# Altium schematic sheet STM32F429_Project.SchDoc: STM32F429NIH6核心开发板
size A1; Author: 唐文军 @ TJ; DrawnBy: 唐文军 @ TJ; Revision: V 2.00
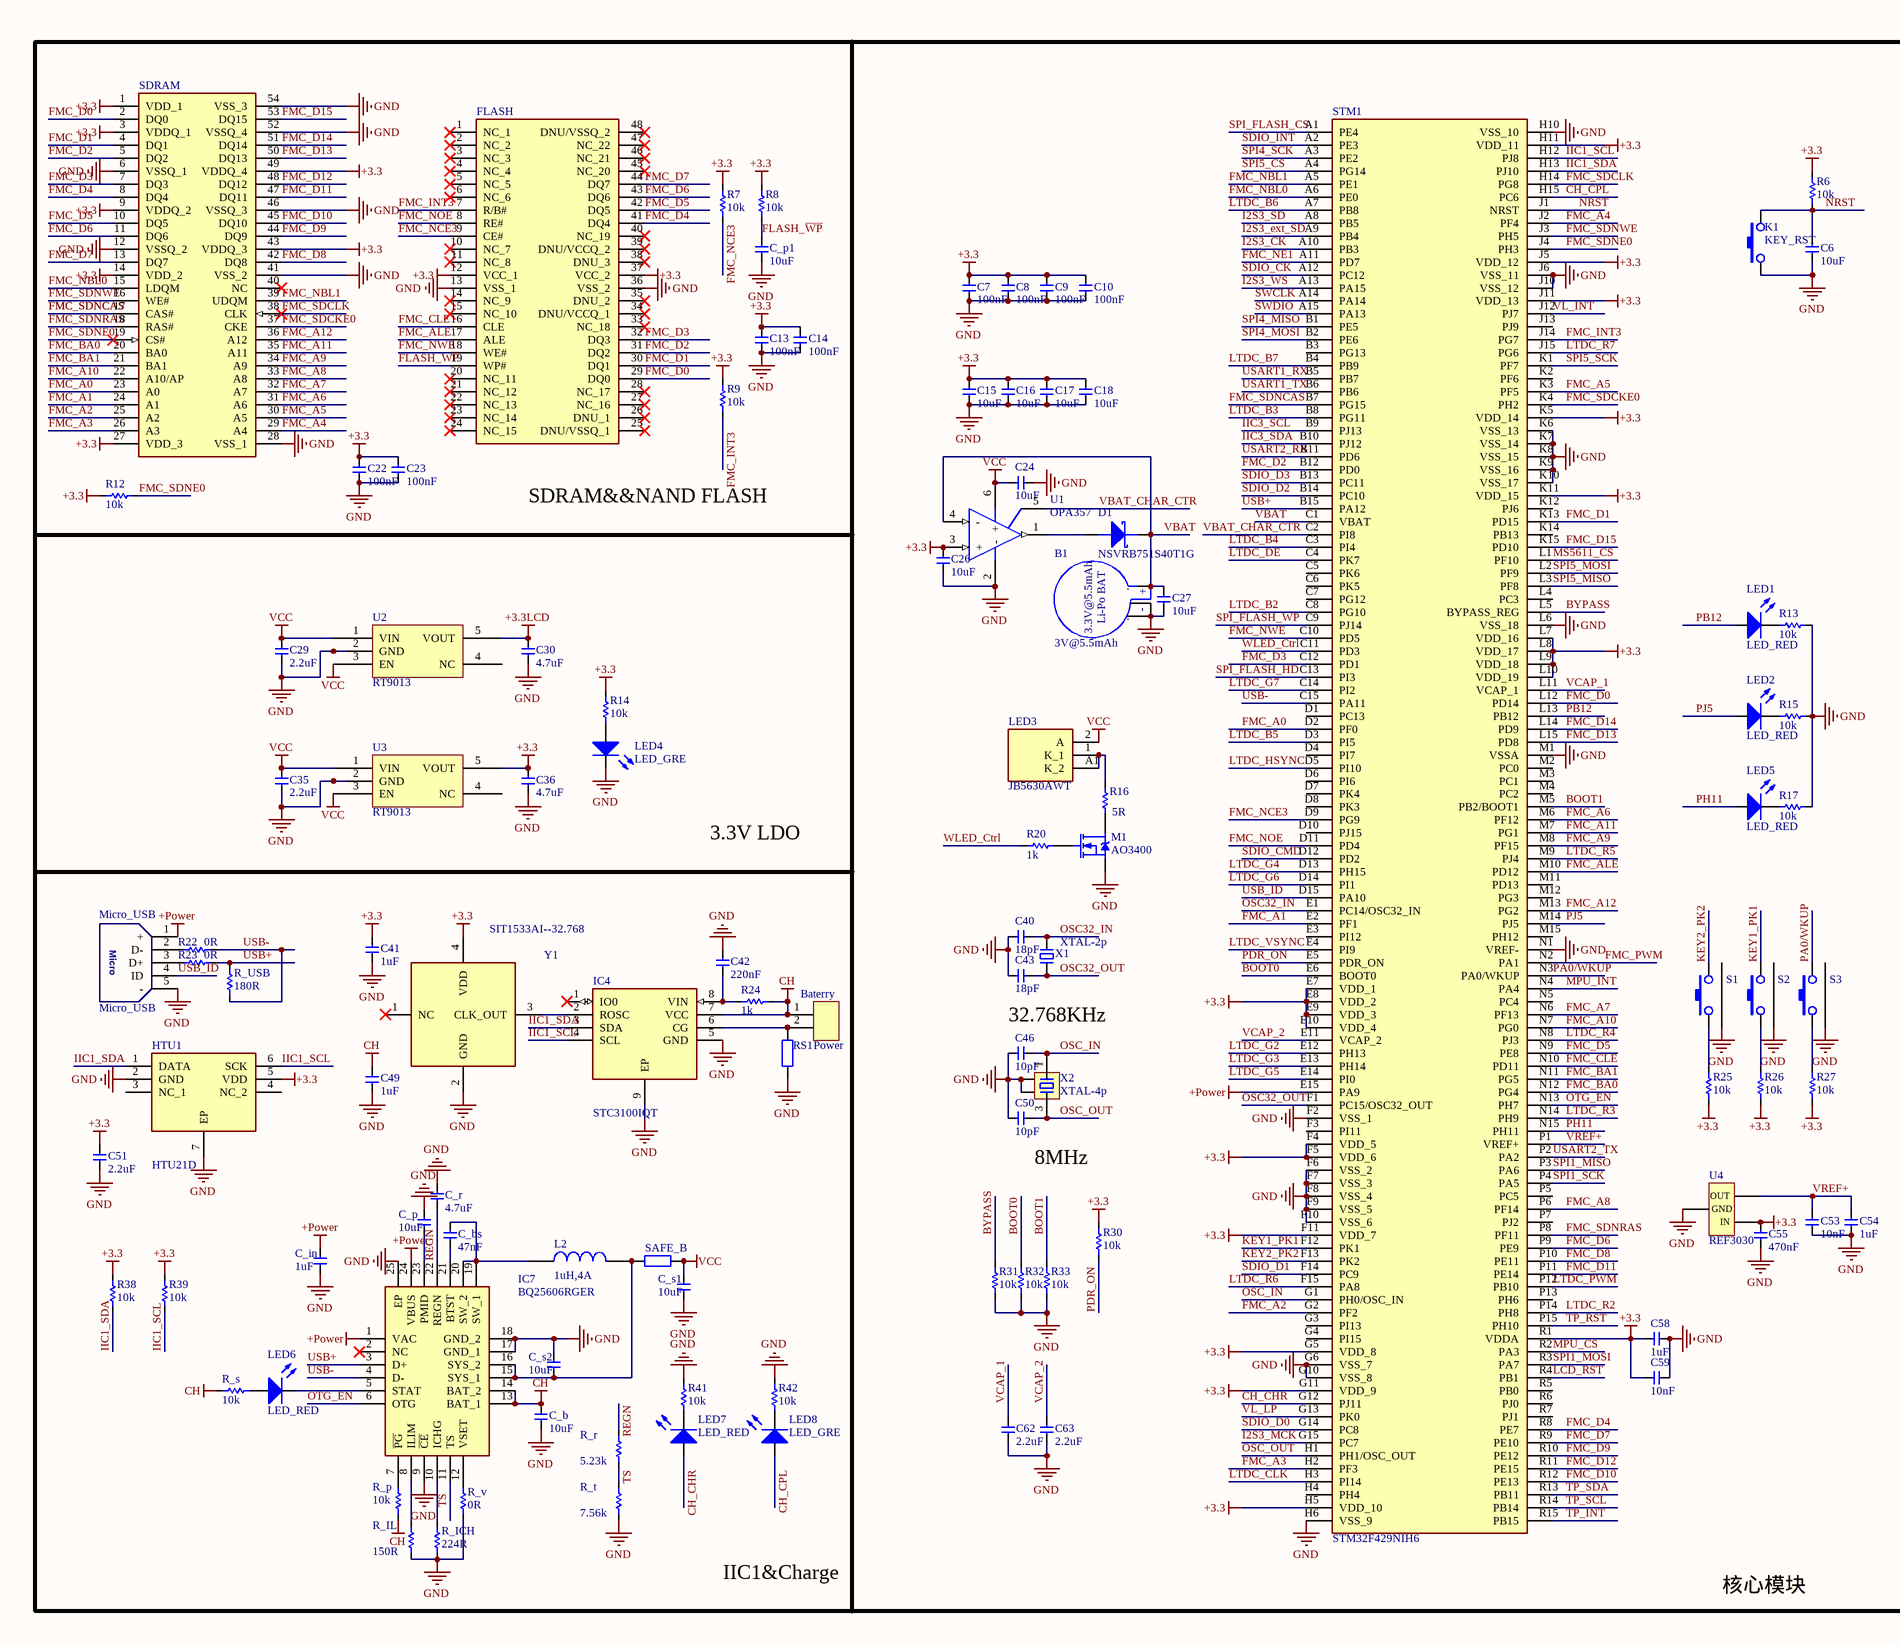
[diagram p0: STM32F429_Project.SchDoc, left]
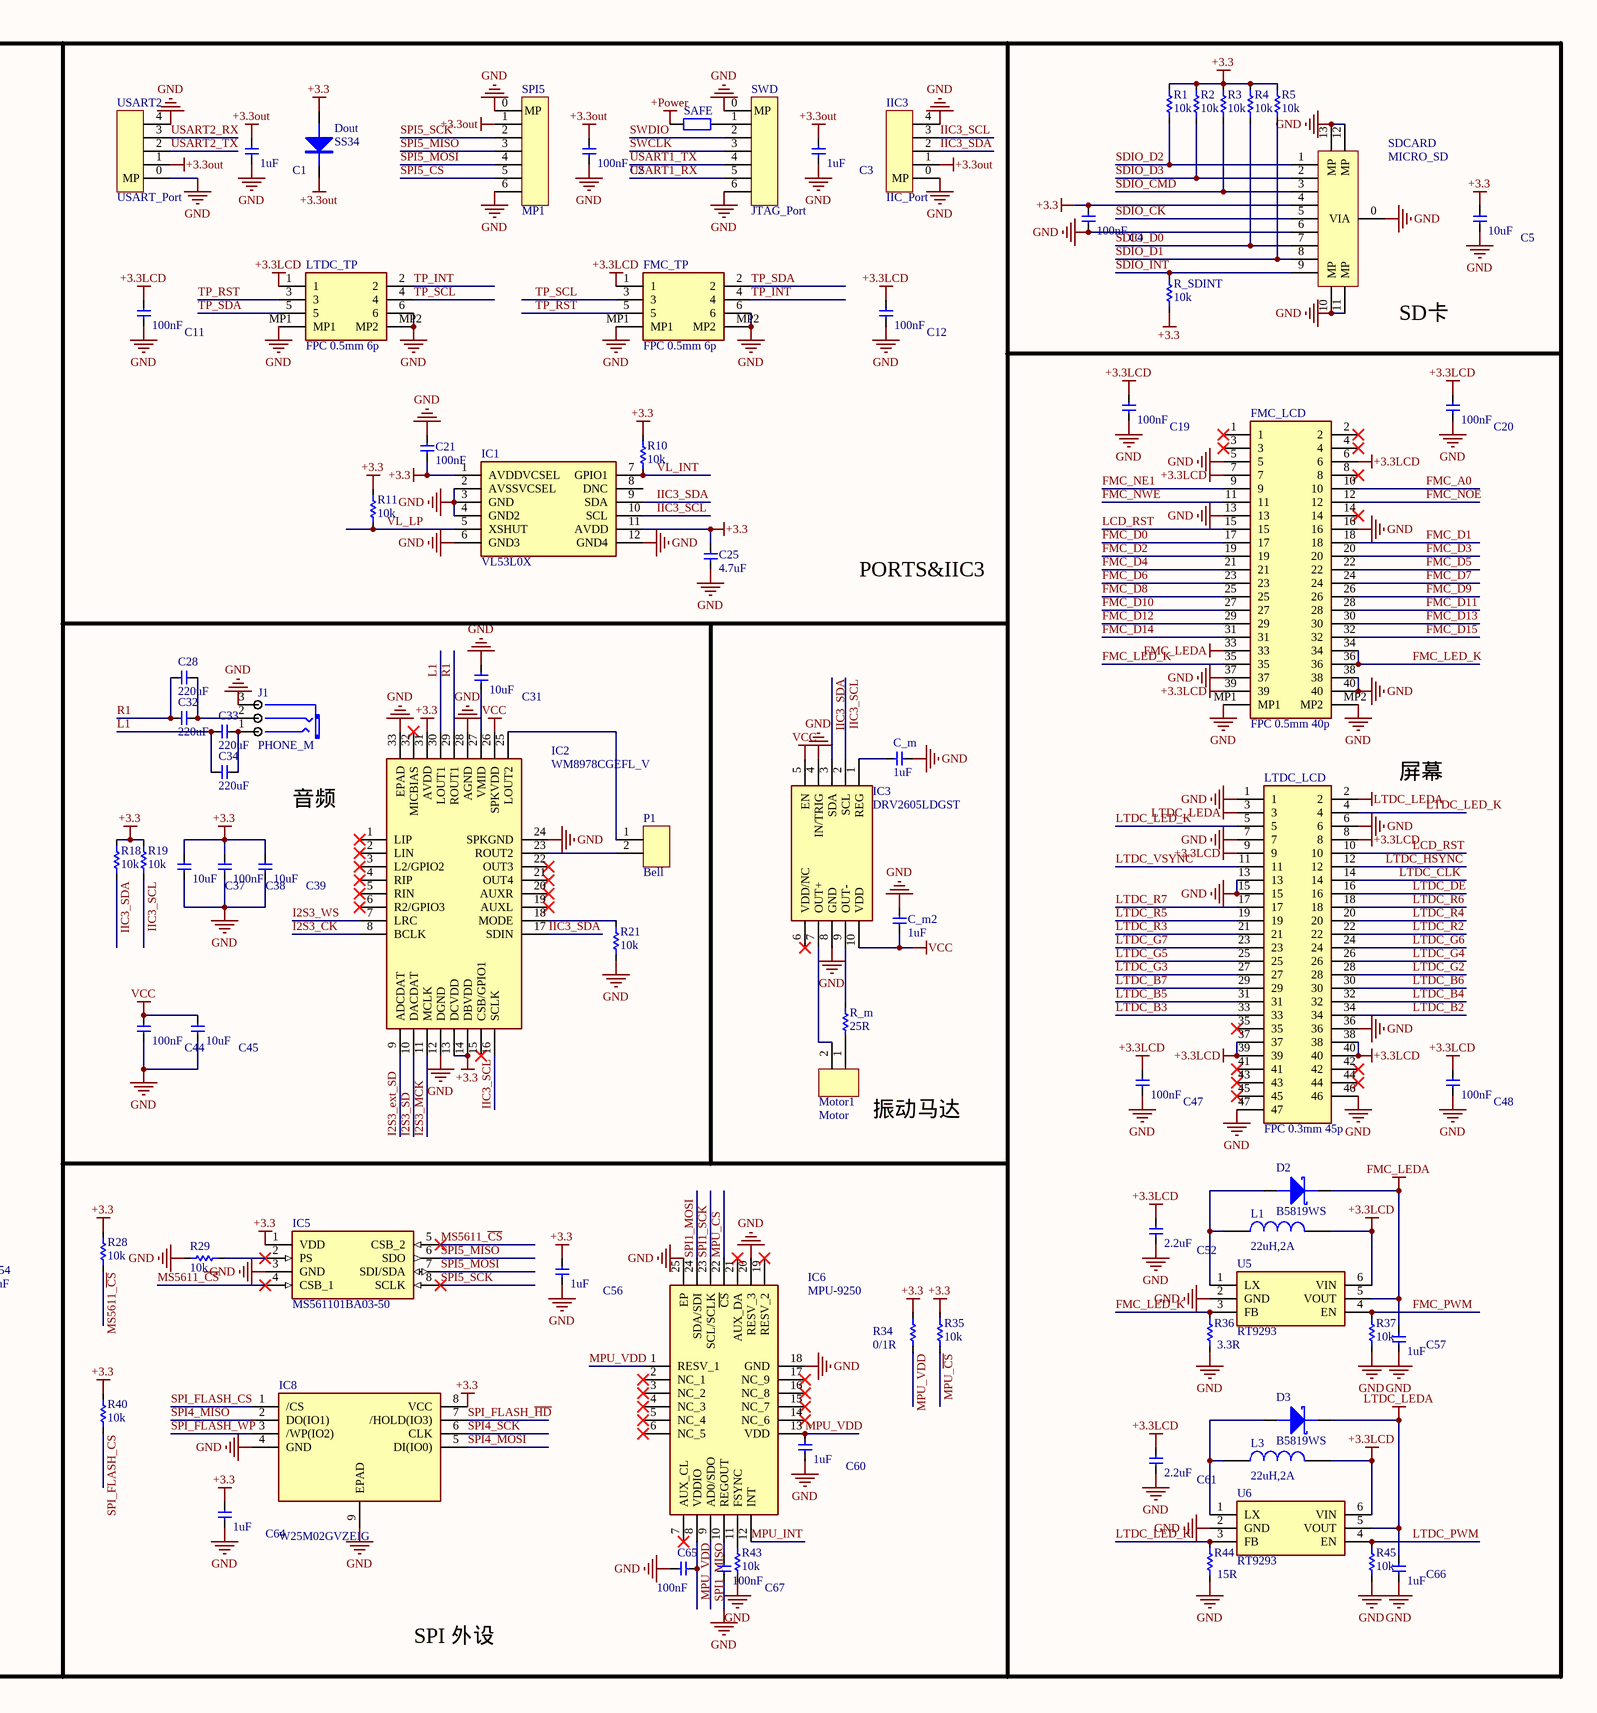
[diagram p1: STM32F429_Project.SchDoc, right]

## Parts
B1  3V@5.5mAh  [3V@2.3mAh]
Baterry  Power  [PADS_2]
C1  1uF  [0402C]
C2  100nF  [0402C]
C3  1uF  [0402C]
C4  100nF  [0402C]
C5  10uF  [0402C]
C6  10uF  [0402C]
C7  100nF  [0402C]
C8  100nF  [0402C]
C9  100nF  [0402C]
C10  100nF  [0402C]
C11  100nF  [0402C]
C12  100nF  [0402C]
C13  100nF  [0402C]
C14  100nF  [0402C]
C15  10uF  [0402C]
C16  10uF  [0402C]
C17  10uF  [0402C]
C18  10uF  [0402C]
C19  100nF  [0402C]
C20  100nF  [0402C]
C21  100nF  [0402C]
C22  100nF  [0402C]
C23  100nF  [0402C]
C24  10uF  [0402C]
C25  4.7uF  [0402C]
C26  10uF  [0402C]
C27  10uF  [0402C]
C28  220uF  [1206C]
C29  2.2uF  [0402C]
C30  4.7uF  [0402C]
C31  10uF  [0402C]
C32  220uF  [1206C]
C33  220uF  [1206C]
C34  220uF  [1206C]
C35  2.2uF  [0402C]
C36  4.7uF  [0402C]
C37  10uF  [0402C]
C38  100nF  [0402C]
C39  10uF  [0402C]
C40  18pF  [0402C]
C41  1uF  [0402C]
C42  220nF  [0402C]
C43  18pF  [0402C]
C44  100nF  [0402C]
C45  10uF  [0402C]
C46  10pF  [0402C]
C47  100nF  [0402C]
C48  100nF  [0402C]
C49  1uF  [0402C]
C50  10pF  [0402C]
C51  2.2uF  [0402C]
C52  2.2uF  [0402C]
C53  10nF  [0402C]
C54  1uF  [0402C]
C55  470nF  [0402C]
C56  1uF  [0402C]
C57  1uF  [0402C]
C58  1uF  [0402C]
C59  10nF  [0402C]
C60  1uF  [0402C]
C61  2.2uF  [0402C]
C62  2.2uF  [0402C]
C63  2.2uF  [0402C]
C64  1uF  [0402C]
C65  100nF  [0402C]
C66  1uF  [0402C]
C67  100nF  [0402C]
C_b  10uF  [0402C]
C_bs  47nF  [0603C]
C_in  1uF  [0402C]
C_m  1uF  [0402C]
C_m2  1uF  [0402C]
C_p  10uF  [0402C]
C_p1  10uF  [0402C]
C_r  4.7uF  [0402C]
C_s1  10uF  [0402C]
C_s2  10uF  [0402C]
D1  NSVRB751S40T1G  [SODFL1608X70N]
D2  B5819WS  [SOD2613X100N]
D3  B5819WS  [SOD2613X100N]
Dout  SS34  [DIODE]
FLASH  (no value)  [SOP50P2000X120-48N]
FMC_LCD  FPC 0.5mm 40p  [FPC 0.5mm 40p]
FMC_TP  FPC 0.5mm 6p  [FPC 0.5mm 6p]
HTU1  HTU21D  [SON100P300X300X100-7N-D]
IC1  VL53L0X  [VL53L0X]
IC2  WM8978CGEFL_V  [QFN50P500X500X100-33N]
IC3  DRV2605LDGST  [SOP50P490X110-10N]
IC4  STC3100IQT  [SON50P300X300X100-9N-D]
IC5  MS561101BA03-50  [MS561101BA03-50]
IC6  MPU-9250  [QFN40P300X300X105-25N-D]
IC7  BQ25606RGER  [QFN50P400X400X100-25N-D]
IC8  W25M02GVZEIG  [SON127P800X600X80-9N-D]
IIC3  IIC_Port  [GX1.25_4p]
J1  PHONE_M  [PJ-320D]
K1  KEY_RST  [KEY_6p]
L1  22uH,2A  [SRP4020]
L2  1uH,4A  [SRP4020]
L3  22uH,2A  [SRP4020]
LED1  LED_RED  [0603LED - White]
LED2  LED_RED  [0603LED - White]
LED3  JB5630AWT  [JB5630AWTC00000000A0HD335E]
LED4  LED_GRE  [0603LED - White]
LED5  LED_RED  [0603LED - White]
LED6  LED_RED  [0603LED - White]
LED7  LED_RED  [0603LED - White]
LED8  LED_GRE  [0603LED - White]
LTDC_LCD  FPC 0.3mm 45p  [FPC 0.3mm 45p]
LTDC_TP  FPC 0.5mm 6p  [FPC 0.5mm 6p]
M1  AO3400  [SOT23-MOS]
Micro_USB  Micro_USB  [Micro_USB_A]
Motor1  Motor  [fxc-110725]
P1  Bell  [PADS_2]
R1  10k  [0402R]
R2  10k  [0402R]
R3  10k  [0402R]
R4  10k  [0402R]
R5  10k  [0402R]
R6  10k  [0402R]
R7  10k  [0402R]
R8  10k  [0402R]
R9  10k  [0402R]
R10  10k  [0402R]
R11  10k  [0402R]
R12  10k  [0402R]
R13  10k  [0402R]
R14  10k  [0402R]
R15  10k  [0402R]
R16  5R  [0603R]
R17  10k  [0402R]
R18  10k  [0402R]
R19  10k  [0402R]
R20  1k  [0402R]
R21  10k  [0402R]
R22  0R  [0603R]
R23  0R  [0603R]
R24  1k  [0402R]
R25  10k  [0402R]
R26  10k  [0402R]
R27  10k  [0402R]
R28  10k  [0402R]
R29  10k  [0402R]
R30  10k  [0402R]
R31  10k  [0402R]
R32  10k  [0402R]
R33  10k  [0402R]
R34  0/1R  [0603R]
R35  10k  [0402R]
R36  3.3R  [0603R]
R37  10k  [0402R]
R38  10k  [0402R]
R39  10k  [0402R]
R40  10k  [0402R]
R41  10k  [0402R]
R42  10k  [0402R]
R43  10k  [0402R]
R44  15R  [0603R]
R45  10k  [0402R]
R_ICH  224R  [0603R]
R_IL  150R  [0603R]
R_m  25R  [0603R]
R_p  10k  [0402R]
R_r  5.23k  [0603R]
R_s  10k  [0402R]
R_SDINT  10k  [0402R]
R_t  7.56k  [0603R]
R_USB  180R  [0603R]
R_v  0R  [0603R]
RS1  0.05R/2512/1%  [2512]  (value not drawn)
S1  (no value)  [KEY_SIDE]
S2  (no value)  [KEY_SIDE]
S3  (no value)  [KEY_SIDE]
SAFE  0.05R/2512/1%  [0603R]  (value not drawn)
SAFE_B  0.05R/2512/1%  [0603R]  (value not drawn)
SDCARD  MICRO_SD  [MICRO_SD]
SDRAM  (no value)  [SOP80P1176X120-54N]
SPI5  MP1  [GX1.25_6p]
STM1  STM32F429NIH6  [BGA216C80P15X15_1300X1300X110]
SWD  JTAG_Port  [GX1.25_6p]
U1  OPA357  [SOT23-6]
U2  RT9013  [SOT23-5]
U3  RT9013  [SOT23-5]
U4  REF3030  [SOT23-3]
U5  RT9293  [SOT23-6]
U6  RT9293  [SOT23-6]
USART2  USART_Port  [GX1.25_4p]
X1  XTAL-2p  [XTAL-2p]
X2  XTAL-4p  [OSC_3225_4p]
Y1  SIT1533AI--32.768  [SIT1533AIH4DCC32768Y]

## Nets
+3.3: C4.2 C5.2 C7.1 C8.1 C9.1 C10.1 C13.1 C14.1 C15.1 C16.1 C17.1 C18.1 C21.1 C22.1 C23.1 C25.2 C26.1 C36.2 C37.2 C38.2 C39.2 C41.2 C51.2 C55.1 C56.2 C58.2 C59.2 C64.2 Dout.A FLASH.12(VCC_1) FLASH.37(VCC_2) HTU1.5(VDD) IC1.1(AVDDVCSEL) IC1.11(AVDD) IC2.13(DCVDD) IC2.14(DBVDD) IC2.31(AVDD) IC5.1(VDD) IC8.8(VCC) R1.1 R2.1 R3.1 R4.1 R5.1 R6.1 R7.1 R8.1 R9.1 R10.1 R11.1 R12.1 R14.1 R18.1 R19.1 R25.2 R26.2 R27.2 R28.2 R30.1 R34.2 R35.2 R38.1 R39.1 R40.2 R_SDINT.2 SDCARD.4 SDRAM.1(VDD_1) SDRAM.3(VDDQ_1) SDRAM.9(VDDQ_2) SDRAM.14(VDD_2) SDRAM.27(VDD_3) SDRAM.43(VDDQ_3) SDRAM.49(VDDQ_4) STM1.E7(VDD_1) STM1.E8(VDD_2) STM1.E9(VDD_3) STM1.E10(VDD_4) STM1.F4(VDD_5) STM1.F5(VDD_6) STM1.F11(VDD_7) STM1.G5(VDD_8) STM1.G11(VDD_9) STM1.H5(VDD_10) STM1.H11(VDD_11) STM1.J5(VDD_12) STM1.J11(VDD_13) STM1.K5(VDD_14) STM1.K11(VDD_15) STM1.L7(VDD_16) STM1.L8(VDD_17) STM1.L9(VDD_18) STM1.L10(VDD_19) STM1.R1(VDDA) U1.3(+) U3.5(VOUT) U4.1(IN) Y1.4(VDD)
+3.3LCD: C11.2 C12.2 C19.2 C20.2 C30.2 C47.2 C48.2 C52.2 C61.2 FMC_LCD.6 FMC_LCD.7 FMC_LCD.39 FMC_TP.1 L1.2 L3.2 LTDC_LCD.8 LTDC_LCD.9 LTDC_LCD.37 LTDC_LCD.38 LTDC_LCD.39 LTDC_LCD.40 LTDC_TP.1 U2.5(VOUT) U5.6(VIN) U6.6(VIN)
+3.3out: C1.2 C2.2 C3.2 Dout.K IIC3.1 SPI5.1 USART2.1
+Power: C_in.2 IC7.1(VAC) IC7.24(VBUS) Micro_USB.1(+) SAFE.2 STM1.E15(PA9)
CH: Baterry.1 C49.2 C_b.2 IC4.7(VCC) IC7.13(BAT_1) IC7.14(BAT_2) R24.2 R_p.2 R_s.1
FMC_LEDA: C57.2 D2.K FMC_LCD.33 U5.5(VOUT)
GND: B1.2(.) C1.1 C2.1 C3.1 C4.1 C5.1 C6.2 C7.2 C8.2 C9.2 C10.2 C11.1 C12.1 C13.2 C14.2 C15.2 C16.2 C17.2 C18.2 C19.1 C20.1 C21.2 C22.2 C23.2 C24.2 C25.1 C26.2 C27.1 C29.1 C30.1 C31.2 C35.1 C36.1 C37.1 C38.1 C39.1 C40.1 C41.1 C42.2 C43.1 C44.1 C45.1 C46.1 C47.1 C48.1 C49.1 C50.1 C51.1 C52.1 C53.1 C54.1 C55.2 C56.1 C57.1 C58.1 C59.1 C60.1 C61.1 C62.1 C63.1 C64.1 C65.2 C66.1 C67.1 C_b.1 C_in.1 C_m.1 C_m2.1 C_p.2 C_p1.2 C_r.2 C_s1.1 C_s2.2 FLASH.13(VSS_1) FLASH.36(VSS_2) FMC_LCD.5 FMC_LCD.13 FMC_LCD.16 FMC_LCD.37 FMC_LCD.38 FMC_LCD.40 FMC_LCD.MP1 FMC_LCD.MP2 FMC_TP.6 FMC_TP.MP1 FMC_TP.MP2 HTU1.2(GND) HTU1.7(EP) IC1.2(AVSSVCSEL) IC1.3(GND) IC1.4(GND2) IC1.6(GND3) IC1.12(GND4) IC2.12(DGND) IC2.24(SPKGND) IC2.28(AGND) IC2.33(EPAD) IC3.4(IN/TRIG) IC3.8(GND) IC4.5(GND) IC4.9(EP) IC5.3(GND) IC6.18(GND) IC6.20(RESV_3) IC6.25(EP) IC7.9(~{CE}) IC7.17(GND_1) IC7.18(GND_2) IC7.25(EP) IC8.4(GND) IC8.9(EPAD) IIC3.0(MP) IIC3.4 J1.3(COM) K1.1 LED4.2 LTDC_LCD.1 LTDC_LCD.6 LTDC_LCD.7 LTDC_LCD.13 LTDC_LCD.15 LTDC_LCD.36 LTDC_LCD.46 LTDC_LCD.47 LTDC_TP.6 LTDC_TP.MP1 LTDC_TP.MP2 M1.S Micro_USB.5(-) R13.2 R15.2 R17.2 R21.1 R29.2 R31.2 R32.2 R33.2 R36.1 R37.2 R41.1 R42.1 R43.1 R44.1 R45.2 R_ICH.1 R_IL.1 R_t.1 R_v.1 RS1.2 S1.3 S2.3 S3.3 SDCARD.0(VIA) SDCARD.6 SDCARD.10(MP) SDCARD.11(MP) SDCARD.12(MP) SDCARD.13(MP) SDRAM.6(VSSQ_1) SDRAM.12(VSSQ_2) SDRAM.28(VSS_1) SDRAM.41(VSS_2) SDRAM.46(VSSQ_3) SDRAM.52(VSSQ_4) SDRAM.54(VSS_3) SPI5.0(MP) SPI5.6 STM1.F2(VSS_1) STM1.F6(VSS_2) STM1.F7(VSS_3) STM1.F8(VSS_4) STM1.F9(VSS_5) STM1.F10(VSS_6) STM1.G6(VSS_7) STM1.G10(VSS_8) STM1.H6(VSS_9) STM1.H10(VSS_10) STM1.J6(VSS_11) STM1.J10(VSS_12) STM1.K6(VSS_13) STM1.K7(VSS_14) STM1.K8(VSS_15) STM1.K9(VSS_16) STM1.K10(VSS_17) STM1.L6(VSS_18) STM1.M1(VSSA) STM1.N1(VREF-) SWD.0(MP) SWD.6 U1.2(-) U2.2(GND) U3.2(GND) U4.3(GND) U5.2(GND) U6.2(GND) USART2.0(MP) USART2.4 X2.2 X2.4 Y1.2(GND)
LTDC_LEDA: C66.2 D3.K LTDC_LCD.2 LTDC_LCD.3 U6.5(VOUT)
VCC: C24.1 C29.2 C35.2 C44.2 C45.2 C_m2.2 C_s1.2 IC2.26(SPKVDD) IC3.5(EN) IC3.10(VDD) LED3.2(A) SAFE_B.1 U1.6(+) U2.1(VIN) U2.3(EN) U3.1(VIN) U3.3(EN)
BOOT0: R32.1 STM1.E6(BOOT0)
BOOT1: R33.1 STM1.M5(PB2/BOOT1)
BYPASS: R31.1 STM1.L5(BYPASS_REG)
CH_CHR: LED7.1 STM1.G12(PJ11)
CH_CPL: LED8.1 STM1.H15(PC6)
FLASH_~{WP}: C_p1.1 FLASH.19(WP#) R8.2
FMC_A0: FMC_LCD.10 SDRAM.23(A0) STM1.D2(PF0)
FMC_A1: SDRAM.24(A1) STM1.E2(PF1)
FMC_A2: SDRAM.25(A2) STM1.G2(PF2)
FMC_A3: SDRAM.26(A3) STM1.H2(PF3)
FMC_A4: SDRAM.29(A4) STM1.J2(PF4)
FMC_A5: SDRAM.30(A5) STM1.K3(PF5)
FMC_A6: SDRAM.31(A6) STM1.M6(PF12)
FMC_A7: SDRAM.32(A7) STM1.N6(PF13)
FMC_A8: SDRAM.33(A8) STM1.P6(PF14)
FMC_A9: SDRAM.34(A9) STM1.M8(PF15)
FMC_A10: SDRAM.22(A10/AP) STM1.N7(PG0)
FMC_A11: SDRAM.35(A11) STM1.M7(PG1)
FMC_A12: SDRAM.36(A12) STM1.M13(PG2)
FMC_ALE: FLASH.17(ALE) STM1.M10(PD12)
FMC_BA0: SDRAM.20(BA0) STM1.N12(PG4)
FMC_BA1: SDRAM.21(BA1) STM1.N11(PG5)
FMC_CLE: FLASH.16(CLE) STM1.N10(PD11)
FMC_D0: FLASH.29(DQ0) FMC_LCD.17 SDRAM.2(DQ0) STM1.L12(PD14)
FMC_D1: FLASH.30(DQ1) FMC_LCD.18 SDRAM.4(DQ1) STM1.K13(PD15)
FMC_D2: FLASH.31(DQ2) FMC_LCD.19 SDRAM.5(DQ2) STM1.B12(PD0)
FMC_D3: FLASH.32(DQ3) FMC_LCD.20 SDRAM.7(DQ3) STM1.C12(PD1)
FMC_D4: FLASH.41(DQ4) FMC_LCD.21 SDRAM.8(DQ4) STM1.R8(PE7)
FMC_D5: FLASH.42(DQ5) FMC_LCD.22 SDRAM.10(DQ5) STM1.N9(PE8)
FMC_D6: FLASH.43(DQ6) FMC_LCD.23 SDRAM.11(DQ6) STM1.P9(PE9)
FMC_D7: FLASH.44(DQ7) FMC_LCD.24 SDRAM.13(DQ7) STM1.R9(PE10)
FMC_D8: FMC_LCD.25 SDRAM.42(DQ8) STM1.P10(PE11)
FMC_D9: FMC_LCD.26 SDRAM.44(DQ9) STM1.R10(PE12)
FMC_D10: FMC_LCD.27 SDRAM.45(DQ10) STM1.R12(PE13)
FMC_D11: FMC_LCD.28 SDRAM.47(DQ11) STM1.P11(PE14)
FMC_D12: FMC_LCD.29 SDRAM.48(DQ12) STM1.R11(PE15)
FMC_D13: FMC_LCD.30 SDRAM.50(DQ13) STM1.L15(PD8)
FMC_D14: FMC_LCD.31 SDRAM.51(DQ14) STM1.L14(PD9)
FMC_D15: FMC_LCD.32 SDRAM.53(DQ15) STM1.K15(PD10)
FMC_INT3: FLASH.7(R/B#) R9.2 STM1.J14(PG7)
FMC_LED_K: FMC_LCD.34 FMC_LCD.35 FMC_LCD.36 R36.2 U5.3(FB)
FMC_NBL0: SDRAM.15(LDQM) STM1.A6(PE0)
FMC_NBL1: SDRAM.39(UDQM) STM1.A5(PE1)
FMC_NCE3: FLASH.9(CE#) R7.2 STM1.D9(PG9)
FMC_NE1: FMC_LCD.9 STM1.A11(PD7)
FMC_NOE: FLASH.8(RE#) FMC_LCD.12 STM1.D11(PD4)
FMC_NWE: FLASH.18(WE#) FMC_LCD.11 STM1.C10(PD5)
FMC_PWM: R37.1 STM1.N2(PA1) U5.4(EN)
FMC_SDCKE0: SDRAM.37(CKE) STM1.K4(PH2)
FMC_SDCLK: SDRAM.38(CLK) STM1.H14(PG8)
FMC_SDNCAS: SDRAM.17(CAS#) STM1.B7(PG15)
FMC_SDNE0: R12.2 SDRAM.19(CS#) STM1.J4(PH3)
FMC_SDNRAS: SDRAM.18(RAS#) STM1.P8(PF11)
FMC_SDNWE: SDRAM.16(WE#) STM1.J3(PH5)
I2S3_CK: IC2.8(BCLK) STM1.A10(PB3)
I2S3_ext_SD: IC2.9(ADCDAT) STM1.A9(PB4)
I2S3_MCK: IC2.11(MCLK) STM1.G15(PC7)
I2S3_SD: IC2.10(DACDAT) STM1.A8(PB5)
I2S3_WS: IC2.7(LRC) STM1.A13(PA15)
IIC1_SCL: HTU1.6(SCK) IC4.4(SCL) R39.2 STM1.H12(PJ8)
IIC1_SDA: HTU1.1(DATA) IC4.3(SDA) R38.2 STM1.H13(PJ10)
IIC3_SCL: IC1.10(SCL) IC2.16(SCLK) IC3.2(SCL) IIC3.3 R19.2 STM1.B9(PJ13)
IIC3_SDA: IC1.9(SDA) IC2.17(SDIN) IC3.3(SDA) IIC3.2 R18.2 STM1.B10(PJ12)
KEY1_PK1: S2.2 STM1.F12(PK1)
KEY2_PK2: S1.2 STM1.F13(PK2)
L1: C33.2 C34.2 IC2.30(LOUT1)
LCD_RST: FMC_LCD.15 LTDC_LCD.10 STM1.R4(PB1)
LTDC_B2: LTDC_LCD.34 STM1.C8(PG10)
LTDC_B3: LTDC_LCD.33 STM1.B8(PG11)
LTDC_B4: LTDC_LCD.32 STM1.C3(PI4)
LTDC_B5: LTDC_LCD.31 STM1.D3(PI5)
LTDC_B6: LTDC_LCD.30 STM1.A7(PB8)
LTDC_B7: LTDC_LCD.29 STM1.B4(PB9)
LTDC_CLK: LTDC_LCD.14 STM1.H3(PI14)
LTDC_DE: LTDC_LCD.16 STM1.C4(PK7)
LTDC_G2: LTDC_LCD.28 STM1.E12(PH13)
LTDC_G3: LTDC_LCD.27 STM1.E13(PH14)
LTDC_G4: LTDC_LCD.26 STM1.D13(PH15)
LTDC_G5: LTDC_LCD.25 STM1.E14(PI0)
LTDC_G6: LTDC_LCD.24 STM1.D14(PI1)
LTDC_G7: LTDC_LCD.23 STM1.C14(PI2)
LTDC_HSYNC: LTDC_LCD.12 STM1.D5(PI10)
LTDC_LED_K: LTDC_LCD.4 LTDC_LCD.5 R44.2 U6.3(FB)
LTDC_PWM: R45.1 STM1.P12(PB10) U6.4(EN)
LTDC_R2: LTDC_LCD.22 STM1.P14(PH8)
LTDC_R3: LTDC_LCD.21 STM1.N14(PH9)
LTDC_R4: LTDC_LCD.20 STM1.N8(PJ3)
LTDC_R5: LTDC_LCD.19 STM1.M9(PJ4)
LTDC_R6: LTDC_LCD.18 STM1.F15(PA8)
LTDC_R7: LTDC_LCD.17 STM1.J15(PG6)
LTDC_VSYNC: LTDC_LCD.11 STM1.E4(PI9)
MPU_~{CS}: IC6.22(~{CS}) R35.1 STM1.R2(PA3)
MPU_INT: IC6.12(INT) STM1.N4(PA4)
MPU_VDD: C60.2 C65.1 IC6.1(RESV_1) IC6.8(VDDIO) IC6.13(VDD) R34.1
MS5611_~{CS}: IC5.4(CSB_1) IC5.5(CSB_2) R28.1 STM1.L1(PF10)
NRST: C6.1 K1.2 R6.2 STM1.J1(NRST)
OSC32_IN: C40.2 STM1.E1(PC14/OSC32_IN) X1.2
OSC32_OUT: C43.2 STM1.F1(PC15/OSC32_OUT) X1.1
OSC_IN: C46.2 STM1.G1(PH0/OSC_IN) X2.1
OSC_OUT: C50.2 STM1.H1(PH1/OSC_OUT) X2.3
OTG_EN: IC7.6(OTG) STM1.N13(PH7)
PA0/WKUP: S3.2 STM1.N3(PA0/WKUP)
PB12: LED1.1 STM1.L13(PB12)
PDR_ON: R30.2 STM1.E5(PDR_ON)
PH11: LED5.1 STM1.N15(PH11)
PJ5: LED2.1 STM1.M14(PJ5)
R1: C28.2 C32.2 IC2.29(ROUT1)
REGN: C_r.1 IC7.22(REGN) R_r.2
SDIO_CK: SDCARD.5 STM1.A12(PC12)
SDIO_CMD: R3.2 SDCARD.3 STM1.D12(PD2)
SDIO_D0: R4.2 SDCARD.7 STM1.G14(PC8)
SDIO_D1: R5.2 SDCARD.8 STM1.F14(PC9)
SDIO_D2: R1.2 SDCARD.1 STM1.B14(PC10)
SDIO_D3: R2.2 SDCARD.2 STM1.B13(PC11)
SDIO_INT: R_SDINT.1 SDCARD.9 STM1.A2(PE3)
SPI1_MISO: IC6.9(AD0/SDO) STM1.P3(PA6)
SPI1_MOSI: IC6.24(SDA/SDI) STM1.R3(PA7)
SPI1_SCK: IC6.23(SCL/SCLK) STM1.P4(PA5)
SPI4_MISO: IC8.2(DO(IO1)) STM1.B1(PE5)
SPI4_MOSI: IC8.5(DI(IO0)) STM1.B2(PE6)
SPI4_SCK: IC8.6(CLK) STM1.A3(PE2)
SPI5_~{CS}: SPI5.5 STM1.A4(PG14)
SPI5_MISO: IC5.6(SDO) SPI5.3 STM1.L3(PF8)
SPI5_MOSI: IC5.7(SDI/SDA) SPI5.4 STM1.L2(PF9)
SPI5_SCK: IC5.8(SCLK) SPI5.2 STM1.K1(PF7)
SPI_FLASH_CS: IC8.1(/CS) R40.1 STM1.A1(PE4)
SPI_FLASH_~{HD}: IC8.7(/HOLD(IO3)) STM1.C13(PI3)
SPI_FLASH_~{WP}: IC8.3(/WP(IO2)) STM1.C9(PJ14)
SWCLK: STM1.A14(PA14) SWD.3
SWDIO: STM1.A15(PA13) SWD.2
TP_INT: FMC_TP.4 LTDC_TP.2 STM1.R15(PB15)
TP_RST: FMC_TP.5 LTDC_TP.3 STM1.P15(PH10)
TP_SCL: FMC_TP.3 LTDC_TP.4 STM1.R14(PB14)
TP_SDA: FMC_TP.2 LTDC_TP.5 STM1.R13(PB11)
TS: IC7.11(TS) R_r.1 R_t.2
USART1_RX: STM1.B5(PB7) SWD.5
USART1_TX: STM1.B6(PB6) SWD.4
USART2_RX: STM1.B11(PD6) USART2.3
USART2_TX: STM1.P2(PA2) USART2.2
USB+: IC7.3(D+) R23.2 R_USB.2 STM1.B15(PA12)
USB-: IC7.4(D-) R22.2 R_USB.1 STM1.C15(PA11)
USB_ID: Micro_USB.4(ID) STM1.D15(PA10)
VBAT: B1.1(.) C27.2 D1.K STM1.C1(VBAT) U1.4(-)
VBAT_CHAR_CTR: STM1.C2(PI8) U1.5
VCAP_1: C62.2 STM1.L11(VCAP_1)
VCAP_2: C63.2 STM1.E11(VCAP_2)
VL_INT: IC1.7(GPIO1) R10.2 STM1.J12(PJ7)
VL_LP: IC1.5(XSHUT) R11.2 STM1.G13(PK0)
VREF+: C53.2 C54.2 STM1.P1(VREF+) U4.2(OUT)
WLED_Ctrl: R20.2 STM1.C11(PD3)
NetBaterry_2: Baterry.2 IC4.6(CG) RS1.1
NetC28_1: C28.1 C32.1 J1.2(CHR)
NetC31_1: C31.1 IC2.27(VMID)
NetC33_1: C33.1 C34.1 J1.1(CHL)
NetC42_1: C42.1 IC4.8(VIN) R24.1
NetC67_2: C67.2 IC6.10(REGOUT)
NetC_bs_1: C_bs.1 IC7.21(BTST)
NetC_bs_2: C_bs.2 IC7.19(SW_1) IC7.20(SW_2) L2.1
NetC_m_2: C_m.2 IC3.1(REG)
NetC_p_1: C_p.1 IC7.23(PMID)
NetC_s2_1: C_s2.1 IC7.15(SYS_1) IC7.16(SYS_2) L2.2 SAFE_B.2
NetD1_A: D1.A U1.1
NetD2_A: D2.A L1.1 U5.1(LX)
NetD3_A: D3.A L3.1 U6.1(LX)
NetIC2_18: IC2.18(MODE) R21.2
NetIC2_23: IC2.23(ROUT2) P1.2
NetIC2_25: IC2.25(LOUT2) P1.1
NetIC3_7: IC3.7(OUT+) Motor1.2
NetIC3_9: IC3.9(OUT-) R_m.2
NetIC4_2: IC4.2(ROSC) Y1.3(CLK_OUT)
NetIC5_2: IC5.2(PS) R29.1
NetIC6_11: IC6.11(FSYNC) R43.2
NetIC7_5: IC7.5(STAT) LED6.2
NetIC7_7: IC7.7(~{PG}) R_p.1
NetIC7_8: IC7.8(ILIM) R_IL.2
NetIC7_10: IC7.10(ICHG) R_ICH.2
NetIC7_12: IC7.12(VSET) R_v.2
NetLED1_2: LED1.2 R13.1
NetLED2_2: LED2.2 R15.1
NetLED3_1: LED3.1(K_1) LED3.A1(K_2) R16.2
NetLED4_1: LED4.1 R14.2
NetLED5_2: LED5.2 R17.1
NetLED6_1: LED6.1 R_s.2
NetLED7_2: LED7.2 R41.2
NetLED8_2: LED8.2 R42.2
NetM1_D: M1.D R16.1
NetM1_G: M1.G R20.1
NetMicro_USB_2: Micro_USB.2(D-) R22.1
NetMicro_USB_3: Micro_USB.3(D+) R23.1
NetMotor1_1: Motor1.1 R_m.1
NetR25_1: R25.1 S1.1
NetR26_1: R26.1 S2.1
NetR27_1: R27.1 S3.1
NetSAFE_1: SAFE.1 SWD.1

Not connected (* = marked no-connect by the designer): FLASH 1(NC_1)* 2(NC_2)* 3(NC_3)* 4(NC_4)* 5(NC_5)* 6(NC_6)* 10(NC_7)* 11(NC_8)* 14(NC_9)* 15(NC_10)* 20(NC_11)* 21(NC_12)* 22(NC_13)* 23(NC_14)* 24(NC_15)* 25(DNU/VSSQ_1)* 26(DNU_1)* 27(NC_16)* 28(NC_17)* 33(NC_18)* 34(DNU/VCCQ_1)* 35(DNU_2)* 38(DNU_3)* 39(DNU/VCCQ_2)* 40(NC_19)* 45(NC_20)* 46(NC_21)* 47(NC_22)* 48(DNU/VSSQ_2)*; FMC_LCD 1* 2* 3* 4* 8* 14*; HTU1 3(NC_1) 4(NC_2); IC1 8(DNC); IC2 1(LIP)* 2(LIN)* 3(L2/GPIO2)* 4(RIP)* 5(RIN)* 6(R2/GPIO3)* 15(CSB/GPIO1)* 19(AUXL)* 20(AUXR)* 21(OUT4)* 22(OUT3)* 32(MICBIAS)*; IC3 6(VDD/NC)*; IC4 1(IO0)*; IC6 2(NC_1)* 3(NC_2)* 4(NC_3)* 5(NC_4)* 6(NC_5)* 7(AUX_CL)* 14(NC_6)* 15(NC_7)* 16(NC_8)* 17(NC_9)* 19(RESV_2)* 21(AUX_DA)*; IC7 2(NC)*; LTDC_LCD 35* 41* 42* 43* 44* 45*; SDRAM 40(NC)*; STM1 B3(PG13) C5(PK6) C6(PK5) C7(PG12) D1(PC13) D4(PI7) D6(PI6) D7(PK4) D8(PK3) D10(PJ15) E3(PI12) F3(PI11) G3(PI13) G4(PI15) H4(PH4) J13(PJ9) K2(PF6) K12(PJ6) K14(PB13) L4(PC3) M2(PC0) M3(PC1) M4(PC2) M11(PD13) M12(PG3) M15(PH12) N5(PC4) P5(PC5) P7(PJ2) P13(PH6) R5(PB0) R6(PJ0) R7(PJ1); U2 4(NC); U3 4(NC); Y1 1(NC)*

## Notes on the sheet
- (near SDCARD) SD卡
- SDRAM&&NAND FLASH
- PORTS&IIC3
- 音频
- 屏幕
- 3.3V LDO
- 32.768KHz
- (near Motor1) 振动马达
- (near C50) 8MHz
- IIC1&Charge
- 核心模块
- SPI 外设
- (in symbol 3V@5.5mAh) +; -; Li-Po BAT; 3.3V@5.5mAh
- (in symbol Micro_USB) Micro

## Library data of the parts
B1 = 3V@5.5mAh: Battery
Baterry = Power: None
C1-C67 C_b C_bs C_in C_m C_m2 C_p C_p1 C_r C_s1 C_s2 = Cap: Value: 18p
D1 = NSVRB751S40T1G: Schottky Diode; Manufacturer_Name: ON Semiconductor; Datasheet Link: https://www.onsemi.com/pub/Collateral/RB751S40T1-D.PDF; Height: 0.7mm; Manufacturer_Part_Number: NSVRB751S40T1G; Mouser Part Number: 863-NSVRB751S40T1G; Mouser Price/Stock: https://www.mouser.com/Search/Refine.aspx?Keyword=863-NSVRB751S40T1G
D2 D3 = B5819WS: Schottky Diode; Manufacturer_Name: MDD（Microdiode Electronics）; Datasheet Link: https://datasheet.lcsc.com/szlcsc/1903051130_MDD-Jiangsu-Yutai-Elec-B5819WS_C64886.pdf; Height: 1mm; Manufacturer_Part_Number: B5819WS
Dout = DIODE: None
FLASH = K9LBG08U0E: Integrated Circuit; Manufacturer_Name: Micron; Manufacturer_Part_Number: MT29F32G08ABAAAWP-ITZ:A; Datasheet Link: https://www.micron.com/~/media/documents/products/data-sheet/nand-flash/70-series/m73a_32gb_64gb_128gb_256gb_asyncsync_nand.pdf; Height: 1.2mm; Mouser Part Number: 340-200226-TRAY; Mouser Price/Stock: https://www.mouser.com/Search/Refine.aspx?Keyword=340-200226-TRAY
FMC_LCD = FPC 0.5mm 40p: Connector; Manufacturer_Name: Kyocera Electronic Components; Manufacturer_Part_Number: 046240040023846+; Datasheet Link: https://componentsearchengine.com/Datasheets/1/046240040023846+.pdf; Height: 2mm; Mouser Part Number: 581-046240040023846+; Mouser Price/Stock: https://www.mouser.com/Search/Refine.aspx?Keyword=581-046240040023846%2B
FMC_TP LTDC_TP = FPC 0.5mm 6p: Connector
HTU1 = HTU21D: Hygrometer; Manufacturer_Name: TE Connectivity; Datasheet Link: http://www.te.com/commerce/DocumentDelivery/DDEController?Action=showdoc&DocId=Data+Sheet%7FHPC199_6%7FA6%7Fpdf%7FEnglish%7FENG_DS_HPC199_6_A6.pdf%7FCAT-HSC0004; Height: 1mm; Manufacturer_Part_Number: HTU21D; Mouser Part Number: 824-HTU21D; Mouser Price/Stock: https://www.mouser.com/Search/Refine.aspx?Keyword=824-HTU21D
IC1 = VL53L0X: Integrated Circuit; Manufacturer_Name: STMicroelectronics; Datasheet Link: https://www.mouser.com/ds/2/389/vl53l0x-1156212.pdf; Height: 1mm; Manufacturer_Part_Number: VL53L0X
IC2 = WM8978CGEFL_V: Integrated Circuit; Manufacturer_Name: WOLFSON MICROELECTRONICS; Manufacturer_Part_Number: WM8978CGEFL/V; Datasheet Link: https://componentsearchengine.com/Datasheets/2/WM8978CGEFL_V.pdf; Height: 1mm
IC3 = DRV2605LDGST: Integrated Circuit; Manufacturer_Name: Texas Instruments; Datasheet Link: http://www.ti.com/lit/ds/symlink/drv2605l.pdf; Height: 1.1mm; Manufacturer_Part_Number: DRV2605LDGST; Mouser Part Number: 595-DRV2605LDGST; Mouser Price/Stock: https://www.mouser.com/Search/Refine.aspx?Keyword=595-DRV2605LDGST; RS Part Number: 9142942P; RS Price/Stock: http://uk.rs-online.com/web/p/products/9142942P
IC4 = STC3100IQT: Integrated Circuit; Manufacturer_Name: STMicroelectronics; Allied_Number: 70521169; Datasheet Link: http://www.st.com/web/en/resource/technical/document/datasheet/CD00219947.pdf; Height: 1mm; Manufacturer_Part_Number: STC3100IQT; Mouser Part Number: 511-STC3100IQT; Mouser Price/Stock: https://www.mouser.com/Search/Refine.aspx?Keyword=511-STC3100IQT; RS Part Number: 1962009; RS Price/Stock: http://uk.rs-online.com/web/p/products/1962009; Allied Price/Stock: http://www.alliedelec.com/stmicroelectronics-stc3100iqt/70521169/
IC5 = MS561101BA03-50: Integrated Circuit; Manufacturer_Name: TE Connectivity; Datasheet Link: http://www.te.com/usa-en/search.html?q=ms5611&source=header; Manufacturer_Part_Number: MS561101BA03-50; Mouser Part Number: 824-MS561101BA03-50; Mouser Price/Stock: https://www.mouser.com/Search/Refine.aspx?Keyword=824-MS561101BA03-50
IC6 = MPU-9250: Integrated Circuit; Manufacturer_Name: InvenSense Inc.; Datasheet Link: https://store.invensense.com/datasheets/invensense/MPU9250REV1.0.pdf; Height: 1.05mm; Manufacturer_Part_Number: MPU-9250; Mouser Part Number: 410-MPU-9250; Mouser Price/Stock: https://www.mouser.com/Search/Refine.aspx?Keyword=410-MPU-9250; RS Part Number: 8837942P; RS Price/Stock: http://uk.rs-online.com/web/p/products/8837942P
IC7 = BQ25606RGER: Integrated Circuit; Manufacturer_Name: Texas Instruments; Datasheet Link: http://www.ti.com/lit/gpn/bq25606; Height: 1mm; Manufacturer_Part_Number: BQ25606RGER; Mouser Part Number: 595-BQ25606RGER; Mouser Price/Stock: https://www.mouser.com/Search/Refine.aspx?Keyword=595-BQ25606RGER
IC8 = W25M02GVZEIG: Integrated Circuit; Manufacturer_Name: Winbond; Datasheet Link: https://www.winbond.com/resource-files/w25m02gv%20revb%20070115.pdf; Height: 0.8mm; Manufacturer_Part_Number: W25M02GVZEIG; Mouser Part Number: 454-W25M02GVZEIG; Mouser Price/Stock: https://www.mouser.com/Search/Refine.aspx?Keyword=454-W25M02GVZEIG
IIC3 USART2 = IIC_Port: None
K1 = KEY_RST: None
L1-L3 = INDUCTOR
LED1 LED2 LED4-LED8 = LED: Typical RED, GREEN, YELLOW, AMBER GaAs LED; Published: 8-Jun-2000; LatestRevisionDate: 17-Jul-2002; LatestRevisionNote: Re-released for DXP Platform.; PackageVersion: Feb-2002; PackageReference: 3.2X1.6X1.1; Publisher: Altium Limited; PackageDescription: SM LED; 2 Flat Leads
LED3 = JB5630AWT-C0-0000-000A0HD335E: LED; Manufacturer_Name: Cree; Datasheet Link: https://www.arrow.com/en/products/jb5630awt-c0-0000-000a0hd335e/cree; Height: 0.6mm; Manufacturer_Part_Number: JB5630AWT-C0-0000-000A0HD335E; Mouser Part Number: 941-JB5630WC0A0HD335; Mouser Price/Stock: https://www.mouser.com/Search/Refine.aspx?Keyword=941-JB5630WC0A0HD335
LTDC_LCD = FPC 0.3mm 45p: Connector; Manufacturer_Name: TE Connectivity; Manufacturer_Part_Number: 4-2328724-5; Allied_Number: 71364589; Datasheet Link: https://www.te.com/commerce/DocumentDelivery/DDEController?Action=showdoc&DocId=Customer+Drawing%7F2328724%7F3%7Fpdf%7FEnglish%7FENG_CD_2328724_3.pdf%7F4-2328724-5; Height: 1.1mm; Mouser Part Number: 571-4-2328724-5; Mouser Price/Stock: https://www.mouser.com/Search/Refine.aspx?Keyword=571-4-2328724-5; Allied Price/Stock: https://www.alliedelec.com/teconnectivity-4-2328724-5/71364589/
M1 = AO3400: N-MOS
Motor1 = Motor: None
P1 = Bell: None
R1-R19 R21-R23 R25-R45 R_ICH R_IL R_m R_p R_r R_s R_SDINT R_t R_USB R_v = Res1: Resistor; Value: 1K; Published: 8-Jun-2000; LatestRevisionDate: 17-Jul-2002; LatestRevisionNote: Re-released for DXP Platform.; PackageReference: AXIAL-0.3; Publisher: Altium Limited; PackageDescription: Axial Device, Thru-Hole; 2 Leads; 0.3 in Pin Spacing
R20 R24 = Res1: Resistor; Published: 8-Jun-2000; LatestRevisionDate: 17-Jul-2002; LatestRevisionNote: Re-released for DXP Platform.; PackageReference: AXIAL-0.3; Publisher: Altium Limited; PackageDescription: Axial Device, Thru-Hole; 2 Leads; 0.3 in Pin Spacing; Value: 1K
RS1 SAFE SAFE_B = Res2: Resistor; Value: 0.01R; Published: 8-Jun-2000; LatestRevisionDate: 17-Jul-2002; LatestRevisionNote: Re-released for DXP Platform.; PackageReference: AXIAL-0.4; Publisher: Altium Limited; PackageDescription: Axial Device, Thru-Hole; 2 Leads; 0.4 in Pin Spacing
S1-S3 = KEY_SIDE: None
SDCARD = MICRO_SD: None
SDRAM = K4S561632J: Integrated Circuit; Manufacturer_Name: Alliance Memory; Manufacturer_Part_Number: AS4C16M16S-7TCN; Datasheet Link: http://www.alliancememory.com/pdf/dram/256m-as4c16m16s.pdf; Height: 1.2mm; Mouser Part Number: 913-AS4C16M16S-7TCN; Mouser Price/Stock: https://www.mouser.com/Search/Refine.aspx?Keyword=913-AS4C16M16S-7TCN; RS Part Number: 7444545P; RS Price/Stock: http://uk.rs-online.com/web/p/products/7444545P
SPI5 = SPI_Port: None
STM1 = STM32F429NIH6: Integrated Circuit; Manufacturer_Name: STMicroelectronics; Datasheet Link: http://www.st.com/content/ccc/resource/technical/document/datasheet/03/b4/b2/36/4c/72/49/29/DM00071990.pdf/files/DM00071990.pdf/jcr:content/translations/en.DM00071990.pdf; Height: 1.1mm; Manufacturer_Part_Number: STM32F429NIH6; Mouser Part Number: 511-STM32F429NIH6; Mouser Price/Stock: https://www.mouser.com/Search/Refine.aspx?Keyword=511-STM32F429NIH6; RS Part Number: 9074750; RS Price/Stock: https://uk.rs-online.com/web/p/products/9074750
SWD = JTAG_Port: None
U1 = OPA690: High Output Current
U2 U3 = RT9013: 3.3VLDO
U4 = REF3030: 3V 电压基准
U5 U6 = RT9293: LCD Supply
X1 = XTAL-2p: 无源晶振
X2 = XTAL-4p: 无源晶振
Y1 = SIT1533AI-H4-DCC-32.768-Y: Crystal or Oscillator; Manufacturer_Name: SiTime; Datasheet Link: https://www.arrow.com/en/products/sit1533ai-h4-dcc-32.768-y/sitime; Height: 0.6mm; Manufacturer_Part_Number: SIT1533AI-H4-DCC-32.768-Y